# EAGLE schematic 32u4 (EAGLE 7.1.0)
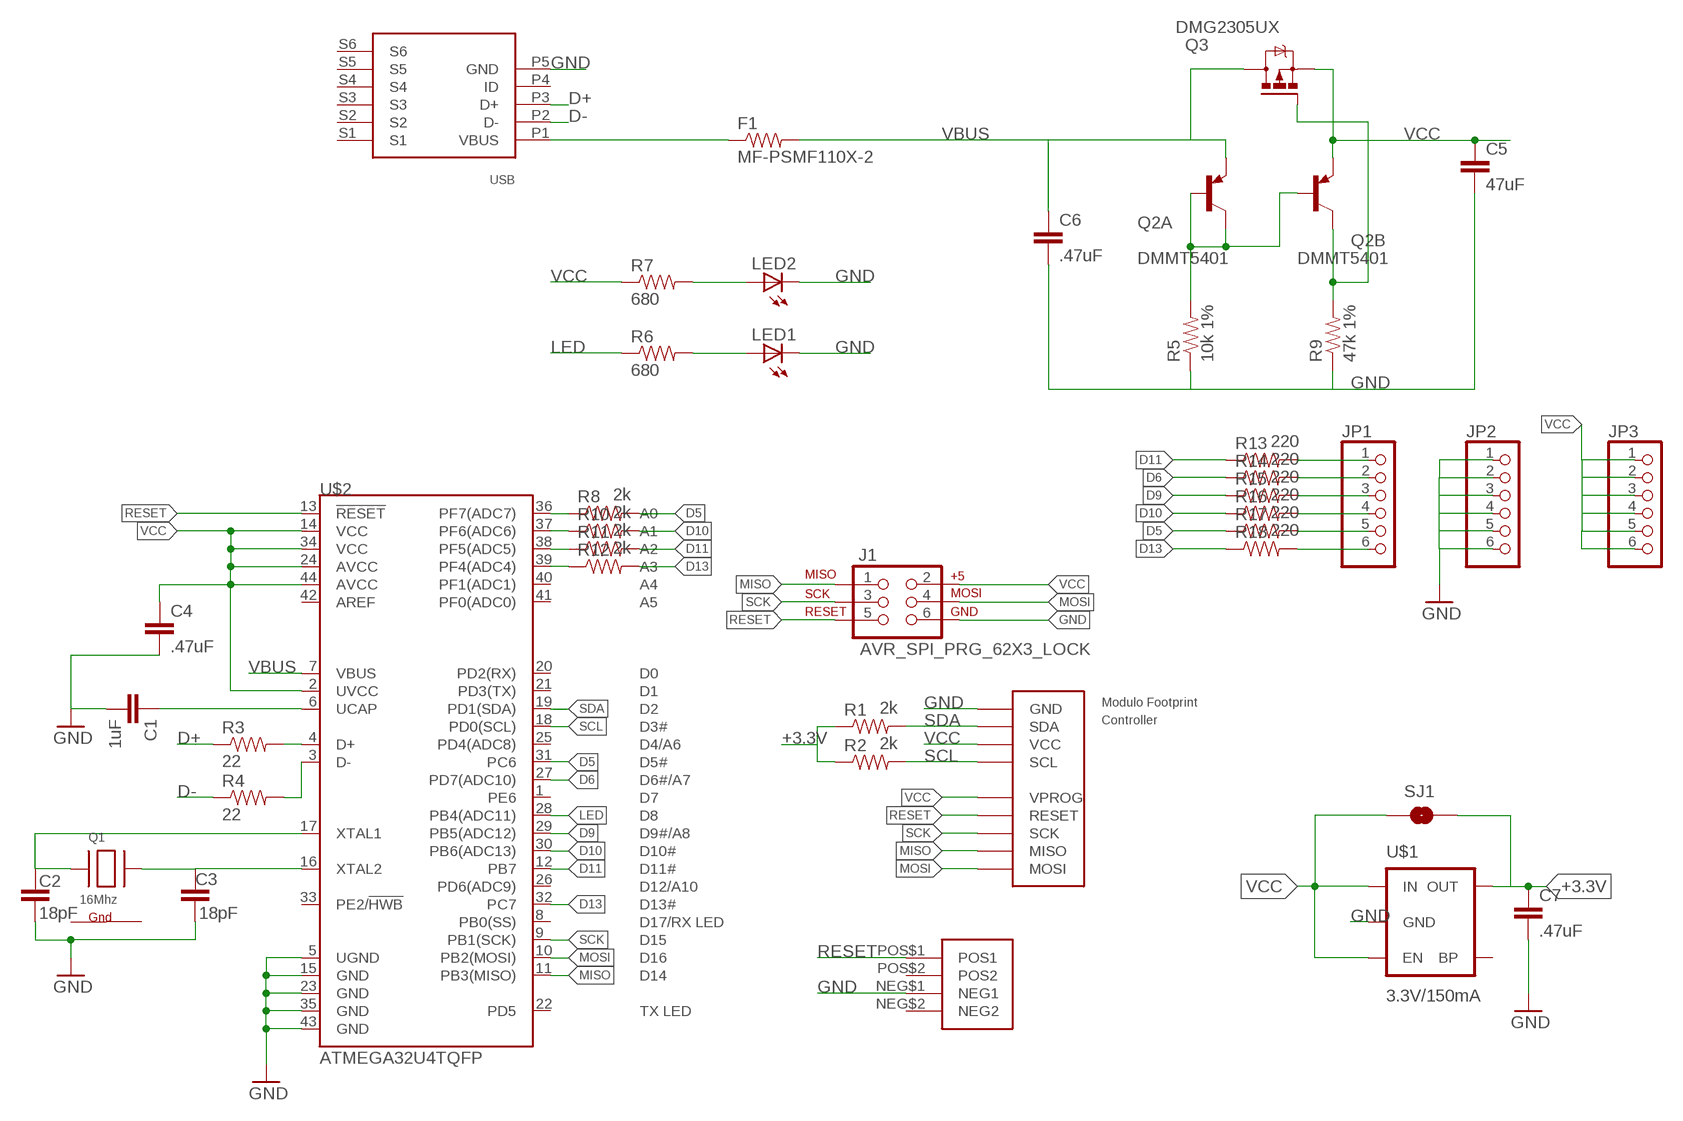
[diagram p0: schematic, sheet 1]

## Parts
C1  1uF  CAP0805  [0805]
C2  18pF  CAP0805  [0805]
C3  18pF  CAP0805  [0805]
C4  .47uF  CAP0805  [0805]
C5  47uF  CAP0805  [0805]
C6  .47uF  CAP0805  [0805]
C7  .47uF  CAP0805  [0805]
F1  MF-PSMF110X-2  RESISTOR0805-RES  [0805]
FOOTPRINT  Controller  FOOTPRINTFOOTPRINT-2  [FOOTPRINT2]
J1  AVR_SPI_PRG_62X3_LOCK  [2X3_LOCK]
JP1  PINHD-1X6LOCK  [1X06-BIGLOCK]
JP2  PINHD-1X6LOCK  [1X06-BIGLOCK]
JP3  PINHD-1X6LOCK  [1X06-BIGLOCK]
LED1  LEDCHIP-LED0805  [CHIP-LED0805]
LED2  LEDCHIP-LED0805  [CHIP-LED0805]
Q1  16Mhz  XTAL-4-3225  [NX3225]
Q2  DMMT5401  TRANSISTOR-DUAL-PNP  [SOT-26]
Q3  DMG2305UX  IRLML5203  [MICRO3]
R1  2k  RESISTOR0805-RES  [0805]
R2  2k  RESISTOR0805-RES  [0805]
R3  22  RESISTOR0805-RES  [0805]
R4  22  RESISTOR0805-RES  [0805]
R5  10k 1%  RESISTOR0805-RES  [0805]
R6  680  RESISTOR0805-RES  [0805]
R7  680  RESISTOR0805-RES  [0805]
R8  2k  RESISTOR0805-RES  [0805]
R9  47k 1%  RESISTOR0805-RES  [0805]
R10  2k  RESISTOR0805-RES  [0805]
R11  2k  RESISTOR0805-RES  [0805]
R12  2k  RESISTOR0805-RES  [0805]
R13  220  RESISTOR0805-RES  [0805]
R14  220  RESISTOR0805-RES  [0805]
R15  220  RESISTOR0805-RES  [0805]
R16  220  RESISTOR0805-RES  [0805]
R17  220  RESISTOR0805-RES  [0805]
R18  220  RESISTOR0805-RES  [0805]
SJ1  SOLDERJUMPERNO  [SJ_2S-NO]
U$1  3.3V/150mA  V_REG_MIC52053.3V  [SOT23-5]
U$2  ATMEGA32U4TQFP  [SPARKFUN-DIGITALIC_TQFP44]
U$4  USBFCI-MICROB  [USB-MICROB-FCI]
U$6  TACT-SWITCHBOURNS-7914J  [BOURNS-7914J]

## Nets
+3.3V: C7.1 R1.1 R2.1 SJ1.2 U$1.5(OUT)
D5: R8.2 R17.1 U$2.31(PC6)
D6: R14.1 U$2.27(PD7(ADC10))
D9: R15.1 U$2.29(PB5(ADC12))
D10: R10.2 R16.1 U$2.30(PB6(ADC13))
D11: R11.2 R13.1 U$2.12(PB7)
D13: R12.2 R18.1 U$2.32(PC7)
D+: R3.1 U$4.P3(D+)
D-: R4.1 U$4.P2(D-)
GND: C1.2 C2.2 C3.2 C4.2 C5.2 C6.2 C7.2 FOOTPRINT.BUS0(GND) J1.6 JP2.1 JP2.2 JP2.3 JP2.4 JP2.5 JP2.6 LED1.C LED2.C R5.1 R9.1 U$1.2(GND) U$2.5(UGND) U$2.15(GND) U$2.23(GND) U$2.35(GND) U$2.43(GND) U$4.P5(GND) U$6.NEG$1(NEG1)
LED: R6.1 U$2.28(PB4(ADC11))
MISO: FOOTPRINT.PROG3(MISO) J1.1 U$2.11(PB3(MISO))
MOSI: FOOTPRINT.PROG4(MOSI) J1.4 U$2.10(PB2(MOSI))
N$1: C1.1 U$2.6(UCAP)
N$2: JP1.1 R13.2
N$3: F1.1 U$4.P1(VBUS)
N$4: C3.1 Q1.3(X2) U$2.16(XTAL2)
N$5: LED1.A R6.2
N$6: R12.1 U$2.39(PF4(ADC4))
N$7: R11.1 U$2.38(PF5(ADC5))
N$8: R3.2 U$2.4(D+)
N$9: R4.2 U$2.3(D-)
N$10: R10.1 U$2.37(PF6(ADC6))
N$11: R8.1 U$2.36(PF7(ADC7))
N$12: LED2.A R7.2
N$13: JP1.2 R14.2
N$14: Q2.1(A:C) Q2.2(A:B) Q2.3(B:B) R5.2
N$15: C2.1 Q1.1(X1) U$2.17(XTAL1)
N$16: Q2.4(B:C) Q3.1(G) R9.2
N$17: JP1.3 R15.2
N$18: JP1.4 R16.2
N$19: JP1.5 R17.2
N$20: JP1.6 R18.2
RESET: FOOTPRINT.PROG1(RESET) J1.5 U$2.13(!RESET) U$6.POS$1(POS1)
SCK: FOOTPRINT.PROG2(SCK) J1.3 U$2.9(PB1(SCK))
SCL: FOOTPRINT.BUS3(SCL) R2.2 U$2.18(PD0(SCL))
SDA: FOOTPRINT.BUS1(SDA) R1.2 U$2.19(PD1(SDA))
VBUS: C6.1 F1.2 Q2.6(A:E) Q3.3(D) U$2.7(VBUS)
VCC: C4.1 C5.1 FOOTPRINT.BUS2(VCC) FOOTPRINT.PROG0(VPROG) J1.2 JP3.1 JP3.2 JP3.3 JP3.4 JP3.5 JP3.6 Q2.5(B:E) Q3.2(S) R7.1 SJ1.1 U$1.1(IN) U$1.3(EN) U$2.2(UVCC) U$2.14(VCC) U$2.24(AVCC) U$2.34(VCC) U$2.44(AVCC)
Unconnected: U$1.4(BP) U$2.1(PE6) U$2.8(PB0(SS)) U$2.20(PD2(RX)) U$2.21(PD3(TX)) U$2.22(PD5) U$2.25(PD4(ADC8)) U$2.26(PD6(ADC9)) U$2.33(PE2/!HWB) U$2.40(PF1(ADC1)) U$2.41(PF0(ADC0)) U$2.42(AREF) U$4.P4(ID) U$4.S1 U$4.S2 U$4.S3 U$4.S4 U$4.S5 U$4.S6 U$6.NEG$2(NEG2) U$6.POS$2(POS2)

## Power pins joined to a net without a drawn wire
G1: Q1.4(G1)
G2: Q1.2(G2)

## Library data of the parts
C1-C7 = SparkFun-Capacitors:CAP: Capacitor Standard 0603 ceramic capacitor, and 0.1" leaded capacitor.
F1 R1-R4 R6-R8 R10-R18 = SparkFun-Resistors:RESISTOR: Resistor Basic schematic elements and footprints for 0603, 1206, and PTH resistors.
FOOTPRINT = IntegerLabs:FOOTPRINT: Modulo Footprint; BOARD: Controller; VERSION: v4
J1 = SparkFun-Connectors:AVR_SPI_PRG_6: AVR ISP 6 Pin This is the reduced ISP connector for AVR programming. Common on Arduino. This footprint will take up less PCB space and can be used with a 10-pin to 6-pin adapter such as SKU: BOB-08508
JP1-JP3 = adafruit:PINHD-1X6: PIN HEADER
LED1 LED2 = adafruit:LED: LED OSRAM: - CHIPLED LG R971, LG N971, LY N971, LG Q971, LY Q971, LO R971, LY R971 LH N974, LH R974 LS Q976, LO Q976, LY Q976 LO Q996 - Hyper CHIPLED LW Q18S LB Q993, LB Q99A, LB R99A - SideLED LS A670, LO A670, LY A670, LG A670, LP A670 LB A673, LV A673, LT A673, LW A673 LH A674 LY A675 LS A676, LA A676, LO A676, LY A676, LW A676 LS A679, LY A679, LG A679 - Hyper Micro SIDELED® LS Y876, LA Y876, LO Y876, LY Y876 LT Y87S - SmartLED LW L88C, LW L88S LB L89C, LB L89S, LG L890 LS L89K, LO L89K, LY L89K LS L896, LA L896, LO L896, LY L896 - TOPLED LS T670, LO T670, LY T670, LG T670, LP T670 LSG T670, LSP T670, LSY T670, LOP T670, LYG T670 LG T671, LOG T671, LSG T671 LB T673, LV T673, LT T673, LW T673 LH T674 LS T676, LA T676, LO T676, LY T676, LB T676, LH T676, LSB T676, LW T676 LB T67C, LV T67C, LT T67C, LS T67K, LO T67K, LY T67K, LW E67C LS E67B, LA E67B, LO E67B, LY E67B, LB E67C, LV E67C, LT E67C LW T67C LS T679, LY T679, LG T679 LS T770, LO T770, LY T770, LG T770, LP T770 LB T773, LV T773, LT T773, LW T773 LH T774 LS E675, LA E675, LY E675, LS T675 LS T776, LA T776, LO T776, LY T776, LB T776 LHGB T686 LT T68C, LB T68C - Hyper Mini TOPLED® LB M676 - Mini TOPLED Santana® LG M470 LS M47K, LO M47K, LY M47K Source: http://www.osram.convergy.de/
Q1 = adafruit:XTAL-4: Classic 4-pin 3.2 x 2.5mm crystal
Q2 = IntegerLabs:TRANSISTOR-DUAL-PNP: PNP Transistor
Q3 = transistor-power:IRLML5203: HEXFET P-Channel Power MOSFET
R5 R9 = SparkFun-Passives:RESISTOR: Resistor Basic schematic elements and footprints for 0603, 1206, and PTH resistors.
SJ1 = SparkFun-Passives:SOLDERJUMPER: Solder Jumper Standard SMD solder jumper. Used to automate production. Two varients : Normally Open and Normally Closed are the same, but have different paste layers. NC will have a large amount of paste and should jumper during reflow.
U$1 = SparkFun-PowerIC:V_REG_MIC5205: V_REG MIC5219 Standard 3.3V and 5V 150mA LDO voltage regulator in SOT-23 layout. Micrel part MIC5205. BP (by-pass) pin is used to lower output noise with 470pF cap, may be left open.; PROD_ID: VREG-00822
U$2 = SparkFun-DigitalIC:ATMEGA32U4: Atmel 44-pin 8-bit Microcontroller with 32KBytes of ISP Flash and USB Controller ----- Please use the QFN-44-NOPAD_1:1 package for the footprint of all boards using a 32U4. Route traces directly away from the pads as much as possible.; PROD_ID: IC-11161
U$4 = IntegerLabs:USB
U$6 = IntegerLabs:TACT-SWITCH